# EAGLE design hemera_A (EAGLE 5.10)
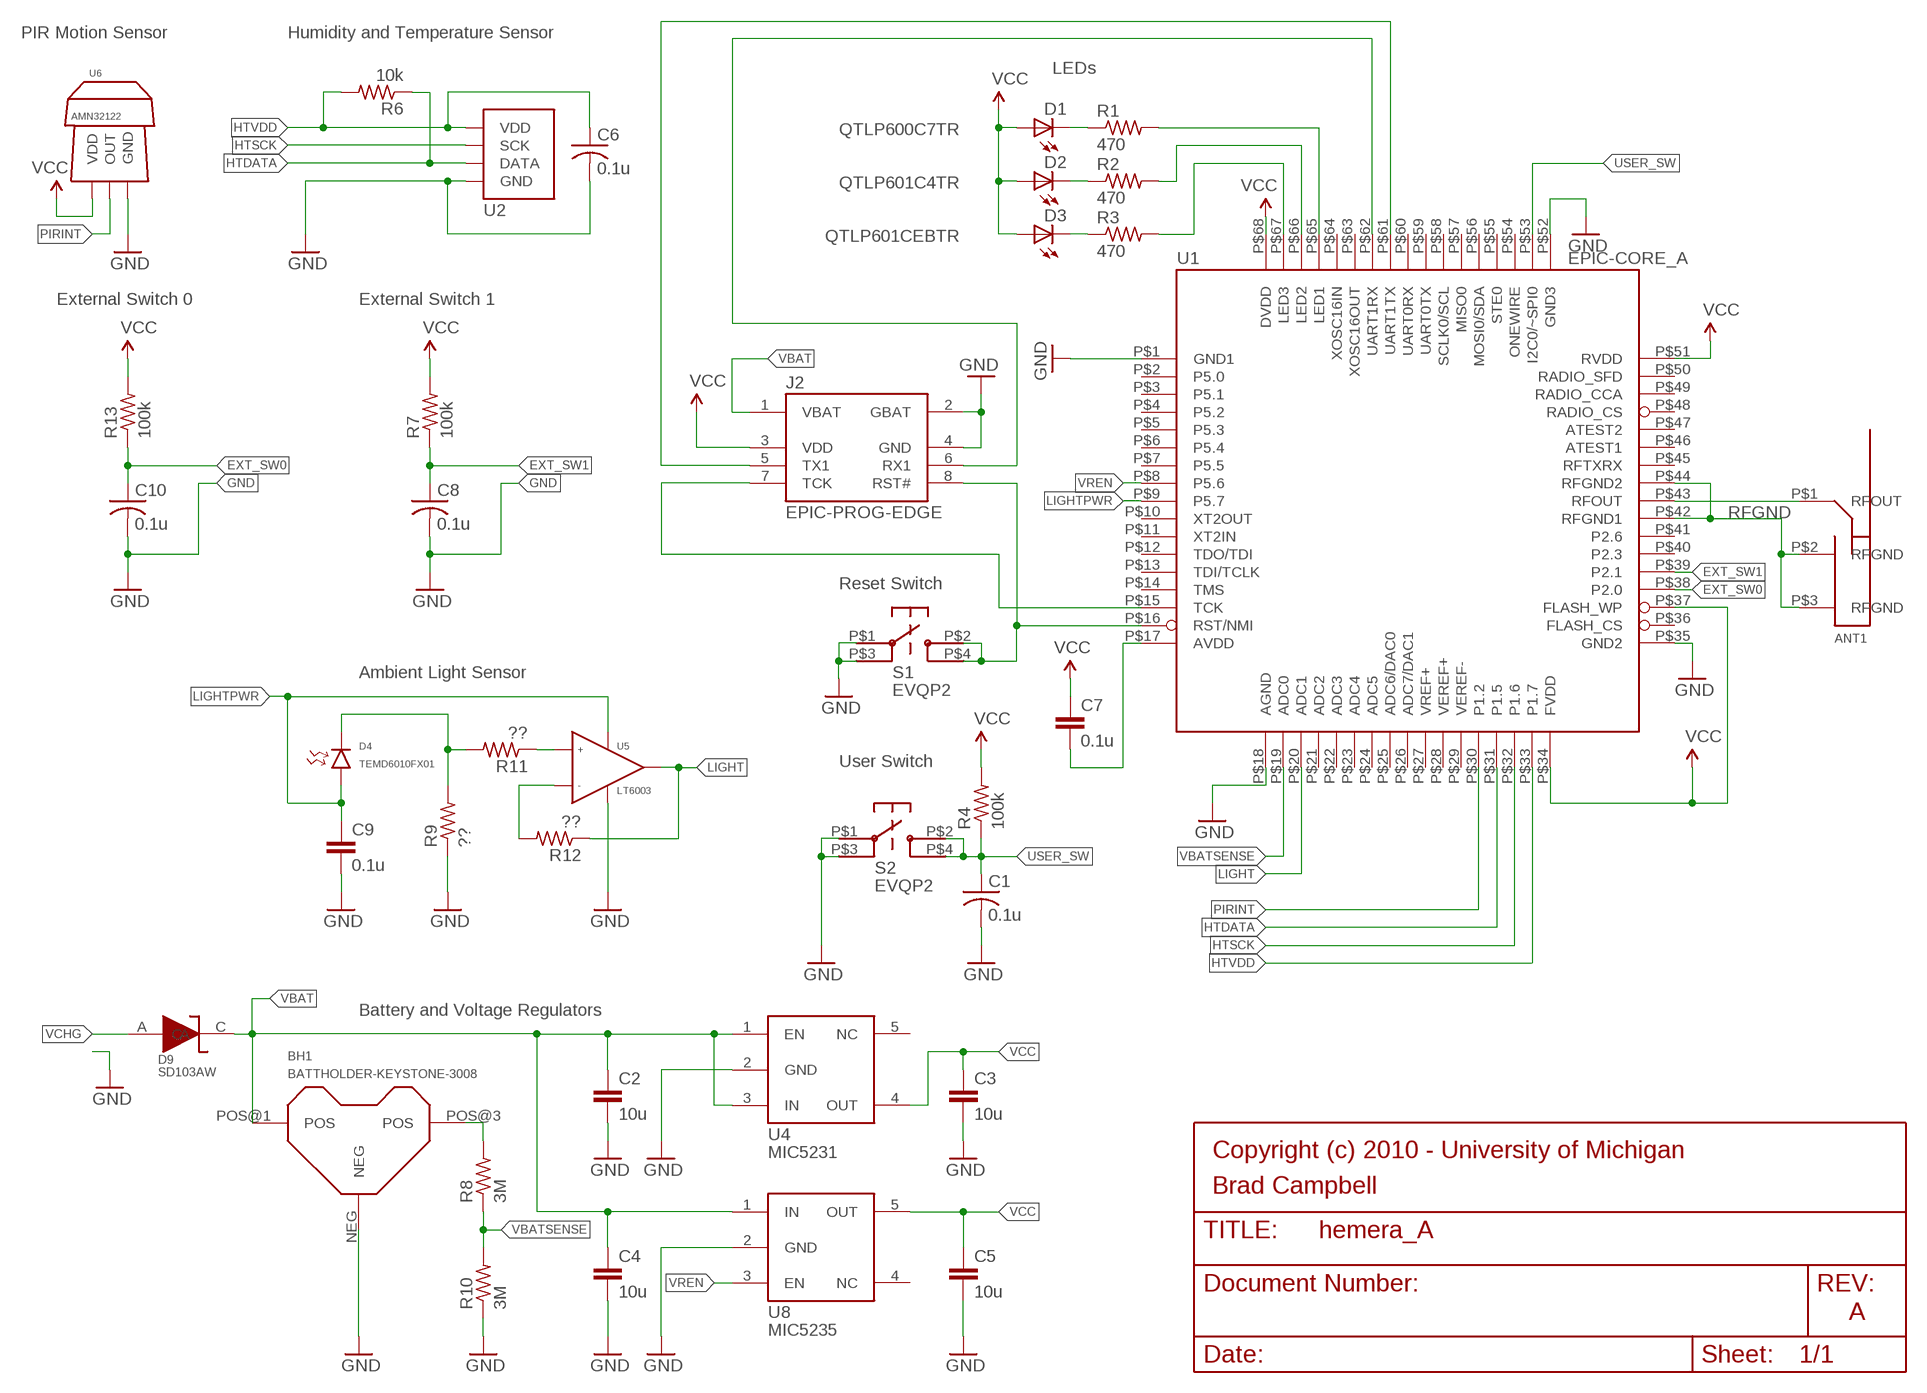
[diagram p0: schematic, sheet 1]

## Parts
ANT1  PIFA-2.4GHZ  [PIFA-2.4GHZ]
BH1  BATTHOLDER-KEYSTONE-3008  [BATTHOLDER-KEYSTONE-3008]
C1  0.1u  C-USC0603  [C0603]
C2  10u  C-EUC0603  [C0603]
C3  10u  C-EUC0603  [C0603]
C4  10u  C-EUC0603  [C0603]
C5  10u  C-EUC0603  [C0603]
C6  0.1u  C-USC0603  [C0603]
C7  0.1u  C-EUC0603  [C0603]
C8  0.1u  C-USC0603  [C0603]
C9  0.1u  C-EUC0603  [C0603]
C10  0.1u  C-USC0603  [C0603]
D1  QTLP600C7TR  LED0603  [LED-0603]
D2  QTLP601C4TR  LED0603  [LED-0603]
D3  QTLP601CEBTR  LED0603  [LED-0603]
D4  TEMD6010FX01  [TEMD6010FX01]
D9  SD103AW  SCHTTKY_DIODE_MINIMELF  [SCHOTTKY_DIODE_MINIMELF]
J2  EPIC-PROG-EDGE  [EPIC-PROG-EDGE]
R1  470  R-US_R0603  [R0603]
R2  470  R-US_R0603  [R0603]
R3  470  R-US_R0603  [R0603]
R4  100k  R-US_R0603  [R0603]
R6  10k  R-US_R0603  [R0603]
R7  100k  R-US_R0603  [R0603]
R8  3M  R-US_R0603  [R0603]
R9  ??  R-US_R0603  [R0603]
R10  3M  R-US_R0603  [R0603]
R11  ??  R-US_R0603  [R0603]
R12  ??  R-US_R0603  [R0603]
R13  100k  R-US_R0603  [R0603]
S1  EVQP2  [EVQP2]
S2  EVQP2  [EVQP2]
U1  EPIC-CORE_A  [EPIC-LCC68]
U2  SHT1XSMD  [SHT1X]
U4  MIC5231  [SOT23-5]
U5  LT6003  [S5]
U6  AMN32122  [PIR]
U8  MIC5235  [SOT23-5]

## Nets
EXT_SW0: C10.1 R13.1 U1.P$38(P2.0)
EXT_SW1: C8.1 R7.1 U1.P$39(P2.1)
GND: BH1.NEG C1.2 C2.2 C3.2 C4.2 C5.2 C6.2 C8.2 C9.2 C10.2 J2.2(GBAT) J2.4(GND) R9.1 R10.1 S1.P$1 S1.P$3 S2.P$1 S2.P$3 U1.P$1(GND1) U1.P$18(AGND) U1.P$35(GND2) U1.P$52(GND3) U2.1(GND) U4.2(GND) U5.2(V-) U6.GND U8.2(GND)
HTDATA: R6.1 U1.P$31(P1.5) U2.2(DATA)
HTSCK: U1.P$32(P1.6) U2.3(SCK)
HTVDD: C6.1 R6.2 U1.P$33(P1.7) U2.4(VDD)
LIGHT: R12.1 U1.P$20(ADC1) U5.1(OUT)
LIGHTPWR: C9.1 D4.EMITTER0 U1.P$9(P5.7) U5.5(V+)
N$1: ANT1.P$1(RFOUT) U1.P$43(RFOUT)
N$2: C7.2 U1.P$17(AVDD)
N$3: D4.COLLECTOR R9.2 R11.2
N$4: J2.7(TCK) U1.P$15(TCK)
N$5: J2.5(TX1) U1.P$61(UART1TX)
N$6: D1.C R1.1
N$7: D2.C R2.1
N$8: D3.C R3.1
N$9: R1.2 U1.P$65(LED1)
N$10: R2.2 U1.P$66(LED2)
N$11: R3.2 U1.P$67(LED3)
N$12: R11.1 U5.3(+)
N$13: J2.6(RX1) U1.P$62(UART1RX)
N$14: R12.2 U5.4(-)
N$16: BH1.POS@3(POS) R8.2
N$27: J2.8(RST#) S1.P$2 S1.P$4 U1.P$16(RST/NMI)
PIRINT: U1.P$30(P1.2) U6.OUT
RFGND: ANT1.P$2(RFGND) ANT1.P$3(RFGND) U1.P$42(RFGND1) U1.P$44(RFGND2)
USER_SW: C1.1 R4.1 S2.P$2 S2.P$4 U1.P$53(I2C0/~SPI0)
VBAT: BH1.POS@1(POS) C2.1 C4.1 D9.C J2.1(VBAT) U4.1(EN) U4.3(IN) U8.1(IN)
VBATSENSE: R8.1 R10.2 U1.P$19(ADC0)
VCC: C3.1 C5.1 C7.1 D1.A D2.A D3.A J2.3(VDD) R4.2 R7.2 R13.2 U1.P$34(FVDD) U1.P$37(FLASH_WP) U1.P$51(RVDD) U1.P$68(DVDD) U4.4(OUT) U6.VDD U8.5(OUT)
VCHG: D9.A
VREN: U1.P$8(P5.6) U8.3(EN)
Unconnected: U1.P$2(P5.0) U1.P$3(P5.1) U1.P$4(P5.2) U1.P$5(P5.3) U1.P$6(P5.4) U1.P$7(P5.5) U1.P$10(XT2OUT) U1.P$11(XT2IN) U1.P$12(TDO/TDI) U1.P$13(TDI/TCLK) U1.P$14(TMS) U1.P$21(ADC2) U1.P$22(ADC3) U1.P$23(ADC4) U1.P$24(ADC5) U1.P$25(ADC6/DAC0) U1.P$26(ADC7/DAC1) U1.P$27(VREF+) U1.P$28(VEREF+) U1.P$29(VEREF-) U1.P$36(FLASH_CS) U1.P$40(P2.3) U1.P$41(P2.6) U1.P$45(RFTXRX) U1.P$46(ATEST1) U1.P$47(ATEST2) U1.P$48(RADIO_CS) U1.P$49(RADIO_CCA) U1.P$50(RADIO_SFD) U1.P$54(ONEWIRE) U1.P$55(STE0) U1.P$56(MOSI0/SDA) U1.P$57(MISO0) U1.P$58(SCLK0/SCL) U1.P$59(UART0TX) U1.P$60(UART0RX) U1.P$63(XOSC16OUT) U1.P$64(XOSC16IN) U4.5(NC) U8.4(NC)

## Notes on the sheet
- PIR Motion Sensor | Humidity and Temperature Sensor
- LEDs
- External Switch 0 | External Switch 1
- Reset Switch
- Ambient Light Sensor
- User Switch
- Battery and Voltage Regulators
- Copyright (c) 2010 - University of Michigan
- Brad Campbell
- A

## Library data of the parts
ANT1 = berkeley-epic:PIFA-2.4GHZ
BH1 = berkeley-epic:BATTHOLDER-KEYSTONE-3008
C1 C6 C8 C10 = rcl:C-US: CAPACITOR, American symbol
C2-C5 C7 C9 = rcl:C-EU: CAPACITOR, European symbol
D1-D3 = berkeley-epic:LED: LEDs Standard schematic elements and footprints for 5mm, 3mm, 1206, and 0603 sized LEDs. 5mm - Spark Fun Electronics SKU : COM-00529 (and others)
D4 = brad:TEMD6010FX01: Ambient Light Sensor
D9 = berkeley-epic:SCHTTKY_DIODE_MINIMELF
J2 = berkeley-epic:EPIC-PROG-EDGE
R1-R4 R6-R13 = rcl:R-US_: RESISTOR, American symbol
S1 S2 = berkeley-epic:EVQP2
U1 = berkeley-epic:EPIC-CORE_A
U2 = berkeley-epic:SHT1X: SHT1x Humdity Sensor Sensirion humdity sensor. Schematic element and footprint proven. Spark Fun Electronics SKU : COM-08227
U4 = berkeley-epic:MIC5231
U5 = brad:LT6003: Low Power Single Op-Amp
U6 = brad:AMN32122: PIR motion detector.
U8 = berkeley-epic:MIC5235

## Board
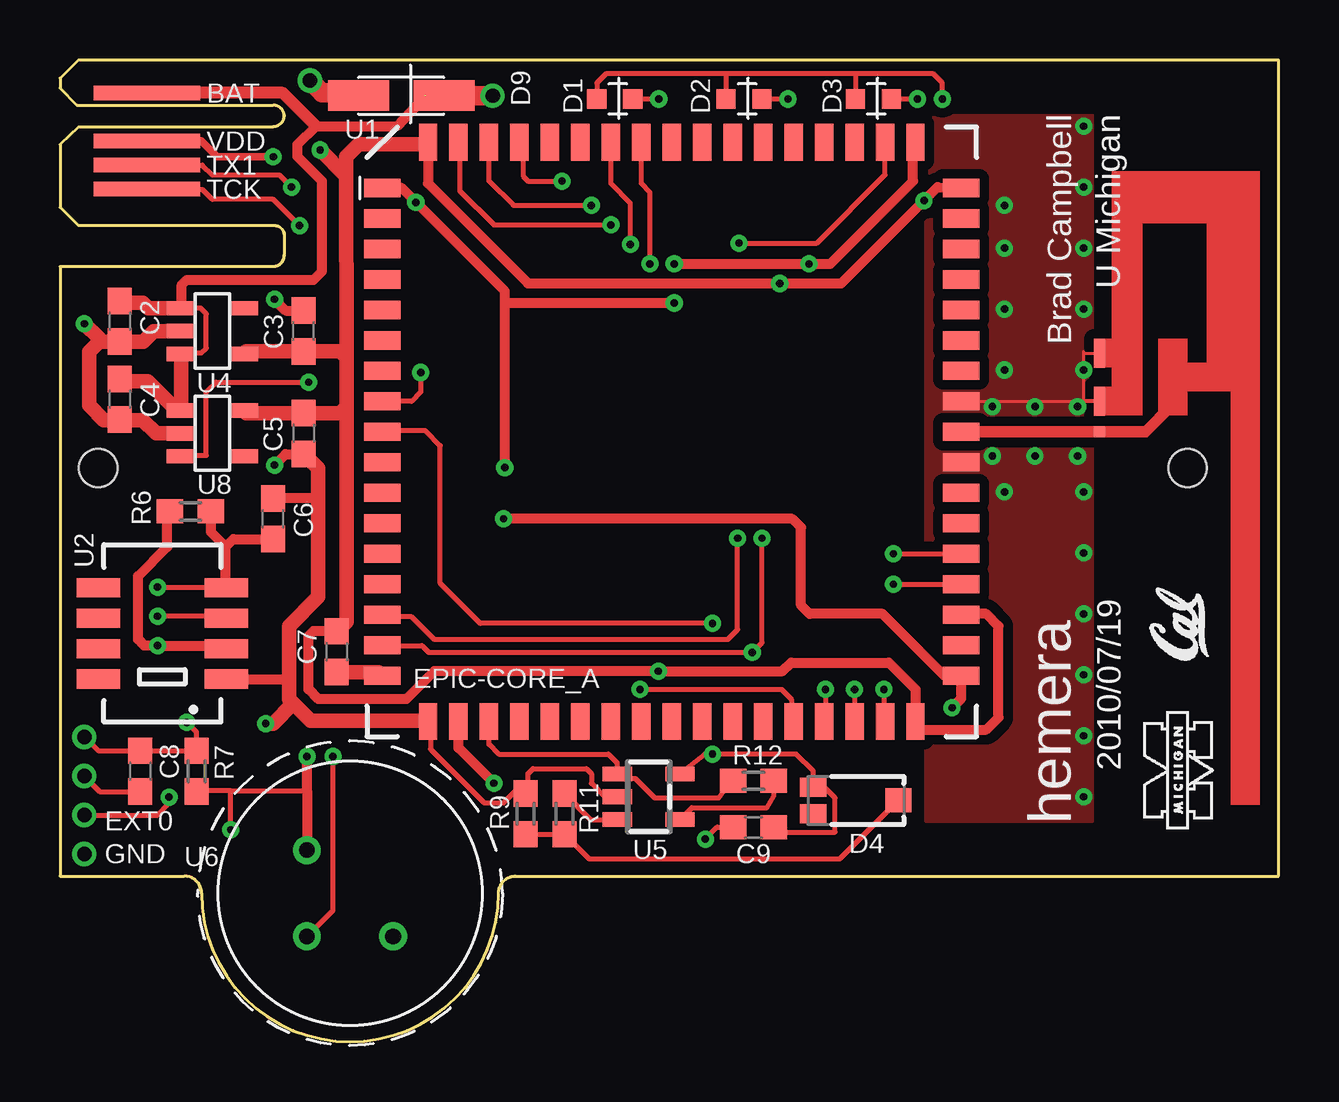
[diagram p1: board, top side]
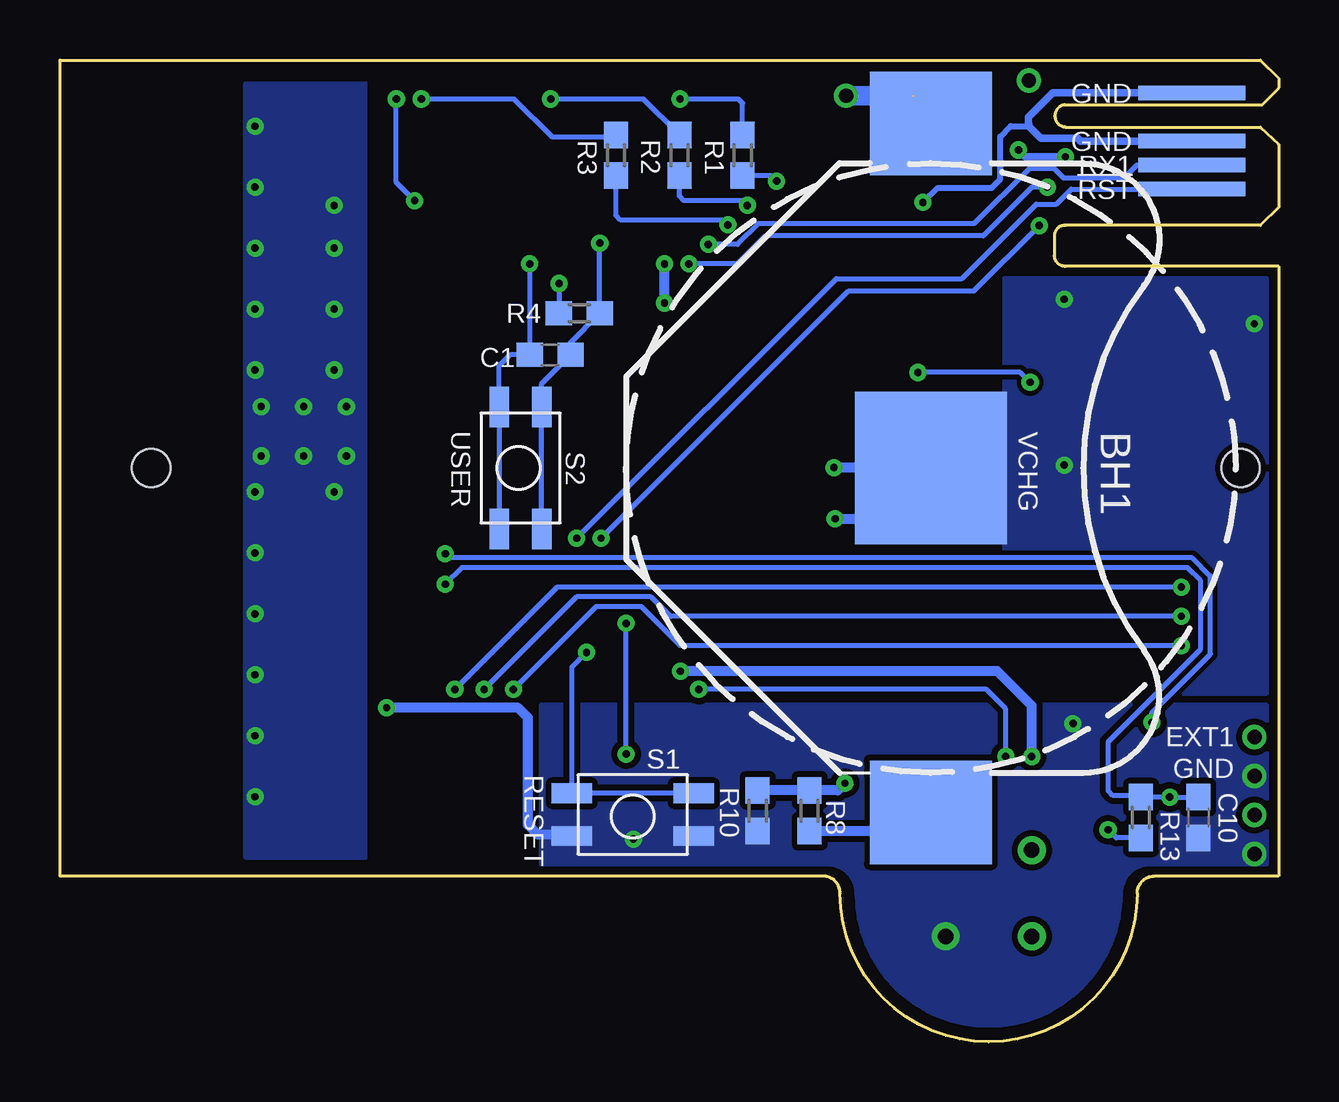
[diagram p2: board, bottom side, seen from below]

Size 50.8 x 40.91 mm. Coordinates in mm from the lower left corner, seen from the top.
Outline: 0,39.74 0.7,39.03 8.89,39.03
Outline: 8.89,39.04 arc-177 8.89,38.13 8.89,38.11 0.76,38.11 0,37.39 0,34.77 0.76,34.02 8.89,34.02 arc-90 9.35,33.63 9.35,32.79 arc-93 8.89,32.31 0,32.31 0,6.91 5.18,6.91 arc-90 5.9,6.19 arc180 18.28,6.19 arc-90 19,6.91 50.8,6.91 50.8,40.91 0.76,40.91 0,40.16 0,39.75
Copper layers (1*16): Top 0.035mm / dielectric 1.5mm / Bottom 0.035mm
Design rules "default *": minimum track width 8mil, minimum drill 12mil, track to track 8mil, track to pad 8mil, pad to pad 8mil, via to via 8mil, smd to smd 8mil, copper to edge 10mil, drill to drill 8mil, minimum pad ring 10mil, minimum via ring 8mil, stop-mask expansion 4mil, vias tented up to drill 19mil, thermal gap 10mil
Holes 1.6 mm at 1.59,23.91 47,23.91

### Footprints (pad centres in the part's own frame; a part is rotated, then mirrored left to right if it is on the bottom)
PIFA-2.4GHZ = smd 0.46 x 0.46: P$1 -2.65,-1.495 | smd 0.46 x 1.2: P$2 -2.655,1.785; P$3 -2.65,-0.215
BATTHOLDER-KEYSTONE-3008 = smd 6.35 x 6.35: NEG 0,0 | smd 4.318 x 5.08: POS@1 -14.351,0; POS@3 14.351,0
C0603 = smd 1.1 x 1: 1 -0.85,0; 2 0.85,0
LED-0603 = smd 0.8 x 0.8: A 0,-0.75; C 0,0.75
TEMD6010FX01 = smd 1.1 x 1: COLLECTOR 1.775,0 | smd 1.1 x 0.8: EMITTER0 -1.775,0.55; EMITTER1 -1.775,-0.55
SCHOTTKY_DIODE_MINIMELF = smd 2.54 x 1.27: A -1.778,0; C 1.778,0
EPIC-PROG-EDGE = smd 0.61 x 4.445: 1 -1.001,3.619; 3 1.001,3.619; 5 2.002,3.619; 7 3.002,3.619 | smd 0.61 x 4.445 bottom: 2 -1.001,3.619; 4 1.001,3.619; 6 2.002,3.619; 8 3.002,3.619
R0603 = smd 1.1 x 1: 1 -0.85,0; 2 0.85,0
EVQP2 = smd 1.676 x 0.813: P$1 -2.54,-0.87; P$2 -2.54,0.908; P$3 2.54,-0.87; P$4 2.54,0.908
EPIC-LCC68 = smd 1.524 x 0.762: P$1 -12.065,10.16; P$2 -12.065,8.89; P$3 -12.065,7.62; P$4 -12.065,6.35; P$5 -12.065,5.08; P$6 -12.065,3.81; P$7 -12.065,2.54; P$8 -12.065,1.27; P$9 -12.065,0; P$10 -12.065,-1.27; P$11 -12.065,-2.54; P$12 -12.065,-3.81; P$13 -12.065,-5.08; P$14 -12.065,-6.35; P$15 -12.065,-7.62; P$16 -12.065,-8.89; P$17 -12.065,-10.16; P$35 12.065,-10.16; P$36 12.065,-8.89; P$37 12.065,-7.62; P$38 12.065,-6.35; P$39 12.065,-5.08; P$40 12.065,-3.81; P$41 12.065,-2.54; P$42 12.065,-1.27; P$43 12.065,0; P$44 12.065,1.27; P$45 12.065,2.54; P$46 12.065,3.81; P$47 12.065,5.08; P$48 12.065,6.35; P$49 12.065,7.62; P$50 12.065,8.89; P$51 12.065,10.16 | smd 0.762 x 1.524: P$18 -10.16,-12.065; P$19 -8.89,-12.065; P$20 -7.62,-12.065; P$21 -6.35,-12.065; P$22 -5.08,-12.065; P$23 -3.81,-12.065; P$24 -2.54,-12.065; P$25 -1.27,-12.065; P$26 0,-12.065; P$27 1.27,-12.065; P$28 2.54,-12.065; P$29 3.81,-12.065; P$30 5.08,-12.065; P$31 6.35,-12.065; P$32 7.62,-12.065; P$33 8.89,-12.065; P$34 10.16,-12.065; P$52 10.16,12.065; P$53 8.89,12.065; P$54 7.62,12.065; P$55 6.35,12.065; P$56 5.08,12.065; P$57 3.81,12.065; P$58 2.54,12.065; P$59 1.27,12.065; P$60 0,12.065; P$61 -1.27,12.065; P$62 -2.54,12.065; P$63 -3.81,12.065; P$64 -5.08,12.065; P$65 -6.35,12.065; P$66 -7.62,12.065; P$67 -8.89,12.065; P$68 -10.16,12.065
SHT1X = smd 1.8 x 0.8: 1 -2.667,1.905; 2 -2.667,0.635; 3 -2.667,-0.635; 4 -2.667,-1.905; 5 2.667,-1.905; 6 2.667,-0.635; 7 2.667,0.635; 8 2.667,1.905
SOT23-5 = smd 0.6 x 1.2: 1 -0.95,-1.306; 2 0,-1.306; 3 0.95,-1.306; 4 0.95,1.306; 5 -0.95,1.306
S5 = smd 0.62 x 1.22: 1 -0.95,-1.31; 2 0,-1.31; 3 0.95,-1.31; 4 0.95,1.31; 5 -0.95,1.31
PIR = drill 0.65 round: GND -1.796,1.796; OUT 1.796,1.796; VDD 1.796,-1.796

### Placement (x,y rotation side)
ANT1  45.97,26.91 0 top
BH1  14.5,23.91 270 bottom
C1  30.37,28.63 180 bottom
C2  2.49,30.02 270 top
C3  10.16,29.62 90 top
C4  2.49,26.77 270 top
C5  10.16,25.35 270 top
C6  8.89,21.79 90 top
C7  11.53,16.26 270 top
C8  3.35,11.28 270 top
C9  28.91,8.94 180 top
C10  3.35,9.35 270 bottom
D1  23.13,39.28 270 top
D2  28.52,39.28 270 top
D3  33.91,39.28 270 top
D4  33.17,10.06 0 top
D9  14.22,39.42 0 top
J2  0,38.54 270 top
R1  22.34,36.94 270 bottom
R2  24.98,36.94 270 bottom
R3  27.63,36.94 270 bottom
R4  29.15,30.35 180 bottom
R6  5.44,22.1 0 top
R7  5.69,11.28 270 top
R8  19.56,9.63 270 bottom
R9  19.41,9.5 270 top
R10  21.72,9.63 90 bottom
R11  21.03,9.5 270 top
R12  28.91,10.87 0 top
R13  5.74,9.35 270 bottom
S1  26.92,9.45 0 bottom
S2  31.63,23.91 270 bottom
U1  25.5,25.42 0 top
U2  4.27,17.02 180 top
U4  6.35,29.62 270 top
U5  24.54,10.21 270 top
U6  12.09,6.19 180 top
U8  6.35,25.35 270 top
U$1  [UMICH]  48.26,8.79 90 top
U$3  [CAL1]  48.26,15.8 90 top

### Tracks (layer width: path | path; a pad name or v marks a point on that pad's centre or on a via)
EXT_SW0  (via drill 0.3, 0.6)
  Top 0.203: v34.74,19.07 U1.P$38 | v4.55,10.2 4.55,9.93 4.06,9.45 v1.02,9.45
  Bottom 0.203: C10.1 v4.55,10.2 R13.1 5.8,10.26 6.91,10.26 7.11,10.47 7.11,12.5 3.25,16.36 3.25,19.2 3.81,19.76 34.05,19.76 v34.74,19.07
EXT_SW1  (via drill 0.3, 0.6)
  Top 0.203: v1.02,12.7 1.59,12.13 C8.1 R7.1 5.69,12.9 v5.28,13.31 | v34.74,20.34 U1.P$39
  Bottom 0.203: v5.28,13.31 5.28,13.72 2.85,16.16 2.85,19.41 3.61,20.17 34.57,20.17 v34.74,20.34
GND  (via drill 0.3, 0.6)
  Top 0.203: U5.2 22.71,10.21 22.15,10.77 22.15,11.18 21.95,11.38 19.71,11.38 19.51,11.18 19.51,10.45 | 19.51,10.45 R9.1 | 19.51,10.45 18.99,10.45 18.49,9.96 17.68,9.96 15.44,12.19 15.44,13.25 U1.P$18 | C8.2 1.66,10.43 v1.02,11.08 | C9.2 27.4,8.94 v26.9,8.45
  Top 0.254: 15.24,13.39 15.27,13.35 U1.P$18
  Top 0.406: U4.2 4.94,29.52 | C6.2 10.73,22.64 10.77,22.61 | U2.1 9.53,15.11 9.55,15.09 | U1.P$52 35.56,37.38 35.56,35.87 32.11,32.41 v31.22,32.41 v25.6,32.41 | v37.19,13.92 37.56,14.3 U1.P$35 36.86,15.26 34.29,17.83 31.24,17.83 30.89,18.19 30.89,21.44 30.53,21.79 v18.49,21.79 | v18.54,23.93 18.54,30.79 | 18.54,30.79 18.54,31.27 v14.83,34.98 14.23,35.58 U1.P$1 | C3.2 9.41,30.47 v8.94,30.94 | v8.94,24.03 9.4,24.49 10.16,24.49 | 18.54,30.79 v25.6,30.79
  Top 0.61: 15.24,13.39 10.44,13.39 9.73,14.1 | 9.73,14.1 9.55,14.28 9.55,15.09 9.55,17.32 10.77,18.54 10.77,22.61 10.77,23.89 C5.2 | v8.57,13.26 8.89,13.26 9.73,14.1 | U8.2 4.01,25.35 3.45,25.91 2.5,25.91 | C4.2 2.5,25.91 | 2.5,25.91 1.83,25.91 1.22,26.52 1.22,28.75 1.63,29.16 | 1.63,29.16 2.48,29.16 C2.2 3.47,29.17 3.91,29.62 U4.2 | 1.63,29.16 1.63,29.31 v1.02,29.92
  Bottom 0.203: S2.P$3 S2.P$1 32.51,26.47 32.51,28.14 32.03,28.63 C1.2 v31.22,32.41
  Bottom 0.254: v14.83,34.98 14.2,35.59 11.96,35.59 11.61,35.94 11.61,37.72 11.18,38.15 10.41,38.15
  Bottom 0.305: J2.2 9.41,39.54 10.43,38.52 10.43,38.39 10.41,38.15 9.91,37.64 8.38,37.64 8.27,37.53 J2.4
  Bottom 0.406: v18.54,23.93 14.48,23.93 BH1.NEG 16.62,21.79 v18.49,21.79 | v37.19,13.92 31.7,13.92 31.29,13.51 31.29,9.04 30.89,8.64 29.52,8.64 S1.P$1 | v25.6,30.79 v25.6,32.41
  other vias: 1.02,7.82
  pour Bottom (isolate 0.254, no thermals): 0.51,7.42 0.51,14.02 30.75,14.02 30.75,7.42 18.82,7.42 arc90 17.59,6.19 arc-180 6.59,6.19 arc90 5.36,7.42
  pour Bottom (isolate 0.127, no thermals): 0.51,14.53 0.51,31.8 11.43,31.8 11.43,14.53
HTDATA  (via drill 0.3)
  Top 0.203: U2.2 7.06,16.51 | v31.9,14.68 31.9,13.41 U1.P$31
  Top 0.406: 6.86,16.31 U2.2 6.81,16.51 v4.06,16.51 3.5,16.51 3.25,16.77 3.25,19.41 4.47,20.63 4.47,21.98 R6.1
  Bottom 0.203: v31.9,14.68 28.45,18.14 26.57,18.14 24.94,16.51 v4.06,16.51
HTSCK  (via drill 0.3)
  Top 0.203: v4.06,17.73 7.01,17.73 U2.3 | v33.12,14.68 U1.P$32
  Bottom 0.203: v33.12,14.68 29.26,18.54 26.16,18.54 25.35,17.73 v4.06,17.73
HTVDD  (via drill 0.3)
  Top 0.203: v4.06,18.95 6.91,18.95 6.96,18.95 U2.4 | v34.34,14.68 34.34,13.4 U1.P$33
  Top 0.406: U2.4 6.91,18.95 6.91,20.63 | 6.91,20.63 6.3,21.24 6.3,22.09 R6.2 | C6.1 7.23,20.95 6.91,20.63
  Bottom 0.203: v4.06,18.95 30.07,18.95 v34.34,14.68
LIGHT
  Top 0.203: R12.1 28.02,10.91 27.47,10.16 24.79,10.16 23.98,10.97 23.41,10.97 U5.1 23.23,11.62 22.86,11.99 18.29,11.99 17.88,12.4 U1.P$20
LIGHTPWR  (via drill 0.3)
  Top 0.203: U5.5 26.88,11.99 v27.2,11.99 30.68,11.99 31.4,11.28 D4.EMITTER0 31.44,10.57 31.9,10.57 32.31,10.16 32.31,8.74 29.96,8.74 C9.1 | U1.P$9 13.47,25.45 15.24,25.45 15.85,24.84 15.85,19.1 17.52,17.43 v27.2,17.43
  Bottom 0.203: v27.2,11.99 v27.2,17.43
N$1
  Top 0.406: 43.31,25.42 43.31,25.39 | 43.31,25.42 ANT1.P$1 | 43.31,25.42
  Top 0.47: U1.P$43 43.31,25.42
N$2
  Top 0.61: C7.2 13.29,15.41 U1.P$17
N$3
  Top 0.203: R9.2 R11.2 22.06,7.62 32.51,7.62 D4.COLLECTOR
N$4  (via drill 0.3)
  Top 0.127: 3.66,35.51 3.66,35.53 | 3.66,35.53 J2.7 | 3.66,35.53 3.66,35.56
  Top 0.203: 3.66,35.51 5.94,35.51 6.35,35.1 8.89,35.1 v9.98,34.01 | U1.P$15 13.5,17.73 14.63,17.73 15.6,16.77 27.84,16.77 28.25,17.17 v28.25,20.98
  Bottom 0.203: v9.98,34.01 12.7,31.29 17.93,31.29 v28.25,20.98
N$5  (via drill 0.3)
  Top 0.203: U1.P$61 24.23,35.77 24.59,35.41 v24.59,32.41 | J2.5 5.94,36.53 6.35,36.12 9.14,36.12 v9.65,35.61
  Bottom 0.203: v9.65,35.61 10.29,35.61 12.32,33.58 21.39,33.58 22.55,32.41 v24.59,32.41
N$6  (via drill 0.3)
  Top 0.203: v24.96,39.28 D1.C
  Bottom 0.203: v24.96,39.28 22.52,39.28 22.35,39.12 22.35,37.8 R1.1
N$7  (via drill 0.3)
  Top 0.203: v30.35,39.28 D2.C
  Bottom 0.203: v30.35,39.28 26.48,39.28 R2.1
N$8  (via drill 0.3)
  Top 0.203: v35.74,39.28 D3.C
  Bottom 0.203: v35.74,39.28 31.87,39.28 30.28,37.7 27.72,37.7 R3.1
N$9  (via drill 0.3)
  Top 0.203: v20.93,35.87 19.51,35.87 19.3,36.07 19.3,37.33 U1.P$65
  Bottom 0.203: R1.2 21.16,36.09 v20.93,35.87
N$10  (via drill 0.3)
  Top 0.203: v22.15,34.85 18.9,34.85 17.88,35.87 U1.P$66
  Bottom 0.203: R2.2 24.98,35.25 24.79,35.05 22.35,35.05 v22.15,34.85
N$11  (via drill 0.3)
  Top 0.203: U1.P$67 16.66,37.43 16.66,35.46 18.09,34.04 v22.96,34.04
  Bottom 0.203: R3.2 27.63,34.43 27.43,34.24 23.16,34.24 v22.96,34.04
N$12
  Top 0.203: U5.3 22.12,9.26 R11.1
N$13  (via drill 0.3)
  Top 0.203: U1.P$62 22.96,35.77 23.77,34.95 v23.77,33.23
  Bottom 0.203: J2.6 5.91,36.53 6.45,35.99 8.97,35.99 9.36,36.39 10.4,36.39 12.7,34.09 21.69,34.09 22.55,33.23 v23.77,33.23
N$14
  Top 0.203: R12.2 29.75,10.25 29.46,9.75 26.34,9.75 U5.4
N$16
  Bottom 0.406: R8.2 15.28,8.78 BH1.POS@3
N$27  (via drill 0.3)
  Top 0.203: U1.P$16 13.46,16.56 13.51,16.51 15.09,16.51 15.37,16.22 v28.85,16.22 29.26,16.63 v29.26,20.98
  Bottom 0.203: J2.8 5.52,35.53 5.68,35.5 5.78,35.53 8.65,35.53 9.27,34.9 10.11,34.9 13.21,31.8 18.44,31.8 v29.26,20.98 | S1.P$4 S1.P$2 29.46,15.61 v28.85,16.22
PIRINT  (via drill 0.3)
  Top 0.203: U1.P$30 30.48,13.45 30.48,14.28 30.07,14.68 v24.18,14.68 | v11.38,11.89 11.38,5.48 U6.OUT
  Bottom 0.203: v11.38,11.89 11.38,13.87 12.19,14.68 v24.18,14.68
RFGND  (via drill 0.3)
  Top 0.127: 42.67,28.7 ANT1.P$2 | 42.67,28.7 42.67,28.75 | 42.67,28.7 v42.67,27.99 42.67,26.72 43.43,26.72 43.43,26.7 ANT1.P$3 37.59,26.7 37.59,26.72 | 37.59,24.15 37.59,24.18 | U1.P$42 37.59,24.15 | 37.59,24.15 37.59,24.12
  other vias: 39.37,33.07 39.37,34.85 39.37,30.53 39.37,27.99 42.67,35.61 42.67,33.07 42.67,30.53 38.86,26.47 40.64,26.47 42.42,26.47 38.86,24.41 40.64,24.41 42.42,24.41 42.67,22.91 39.37,22.91 42.67,20.37 42.67,17.83 42.67,15.29 42.67,12.75 42.67,10.21 42.67,38.15
  pour Top (isolate 0.406, no thermals): 43.05,9.2 43.05,38.6 36.07,38.6 36.07,9.2
  pour Bottom: 43.05,7.67 43.05,39.93 38.1,39.93 38.1,7.67
USER_SW  (via drill 0.3)
  Top 0.203: U1.P$53 34.39,36.12 31.55,33.28 v28.3,33.28
  Bottom 0.203: S2.P$4 S2.P$2 30.72,27.43 C1.1 29.52,29.13 R4.1 v28.3,33.28
VBAT  (via drill 0.6)  (1 unrouted)
  Top 0.203: U4.1 5.86,30.57 6.1,30.33 6.1,28.91 5.89,28.7 5.08,28.7 U4.3
  Top 0.406: 15.24,39.42 14.05,38.15 10.67,38.15 9.91,37.39 9.91,36.88 10.92,35.87 10.92,32.11 10.57,31.75 5.28,31.75 5.08,31.55 5.08,30.6 U4.1
  Top 0.508: J2.1 9.28,39.54 10.67,38.15
  Top 0.61: U4.3 U8.1 4.89,26.3 3.66,27.54 2.58,27.54 C4.1 | U4.1 3.67,30.57 3.45,30.79 2.58,30.79 C2.1
  Top 0.813: v18.03,39.42 D9.C
  Bottom 0.406: BH1.POS@1 14.5,39.15 14.48,39.17 14.73,39.42
  Bottom 0.61: BH1.POS@1 14.5,38.73 15.19,39.42
  Bottom 0.813: 14.73,39.42 15.19,39.42 v18.03,39.42
VBATSENSE  (via drill 0.3)
  Top 0.406: U1.P$19 16.61,12.25 v18.09,10.77
  Bottom 0.406: R10.2 R8.1 18.38,10.48 v18.09,10.77
VCC  (via drill 0.3)
  Top 0.203: 11.94,36.45 11.91,36.09 | R7.2 5.73,10.47 7.11,10.47 | 7.11,10.47 10.29,10.47 | v7.11,8.84 7.11,10.47 | D1.A 22.38,39.95 22.76,40.34 27.77,40.34 | 27.77,40.34 D2.A | 33.16,40.34 27.77,40.34 | v36.78,39.28 36.78,39.95 36.4,40.34 33.16,40.34 | 33.16,40.34 D3.A
  Top 0.305: J2.3 5.89,37.54 6.56,36.87 v8.89,36.88 | 37.59,17.83 U1.P$37
  Top 0.406: 11.94,36.87 11.94,36.88 | 15.24,37.39 15.29,37.49 15.3,37.48 U1.P$68 15.34,35.77 19.51,31.6 v30,31.6 32.56,31.6 v36.02,35.05 36.58,35.61 U1.P$51 | U1.P$37 37.56,17.83 37.59,17.83 38.61,17.83 39.12,17.32 39.12,13.51 38.61,13.01 35.69,13.01 35.69,13.32 U1.P$34 35.66,14.68 34.54,15.8 30.48,15.8 30.12,15.44 v24.94,15.44 15.6,15.44 14.43,14.28 10.77,14.28 10.36,14.68 10.36,16.92 10.57,17.12 11.52,17.12 C7.1 | U6.VDD 10.29,10.47 v10.29,11.89
  Top 0.61: 11.94,36.88 12.45,37.39 15.24,37.39 | 11.94,26.47 11.94,20.37 11.94,17.51 C7.1 | 11.94,26.47 11.94,28.5 | 11.94,28.5 11.94,36.45 11.94,36.87 | 11.91,36.09 v10.85,37.16 | 11.94,26.47 11.67,26.2 C5.1 7.76,26.2 U8.5 | 11.94,28.5 11.67,28.77 C3.1 7.76,28.77 U4.4
  Bottom 0.203: R13.2 6.77,8.5 v7.11,8.84 | v36.78,39.28 36.78,35.82 v36.02,35.05 | v30,31.6 R4.2
  Bottom 0.305: v10.85,37.16 10.57,36.88 v8.89,36.88
  Bottom 0.406: v10.29,11.89 10.29,14 11.73,15.44 v24.94,15.44
VCHG  (via drill 0.6)
  Top 0.305: 12.32,39.55 D9.A 12.45,39.3
  Top 0.813: 12.32,39.55 10.92,39.55 v10.41,40.06
VREN  (via drill 0.3)
  Top 0.203: U1.P$8 14.65,26.69 15.04,27.08 v15.04,27.89 | U8.3 5.08,24.44 6.1,24.44 6.1,27.08 6.5,27.48 v10.36,27.48
  Bottom 0.203: v15.04,27.89 10.77,27.89 v10.36,27.48

### Text on the board
tPlace: Brad Campbell | U Michigan | 2010/07/19 | EXT0 | hemera | GND
bPlace: VCHG | USER | EXT1 | GND | RESET